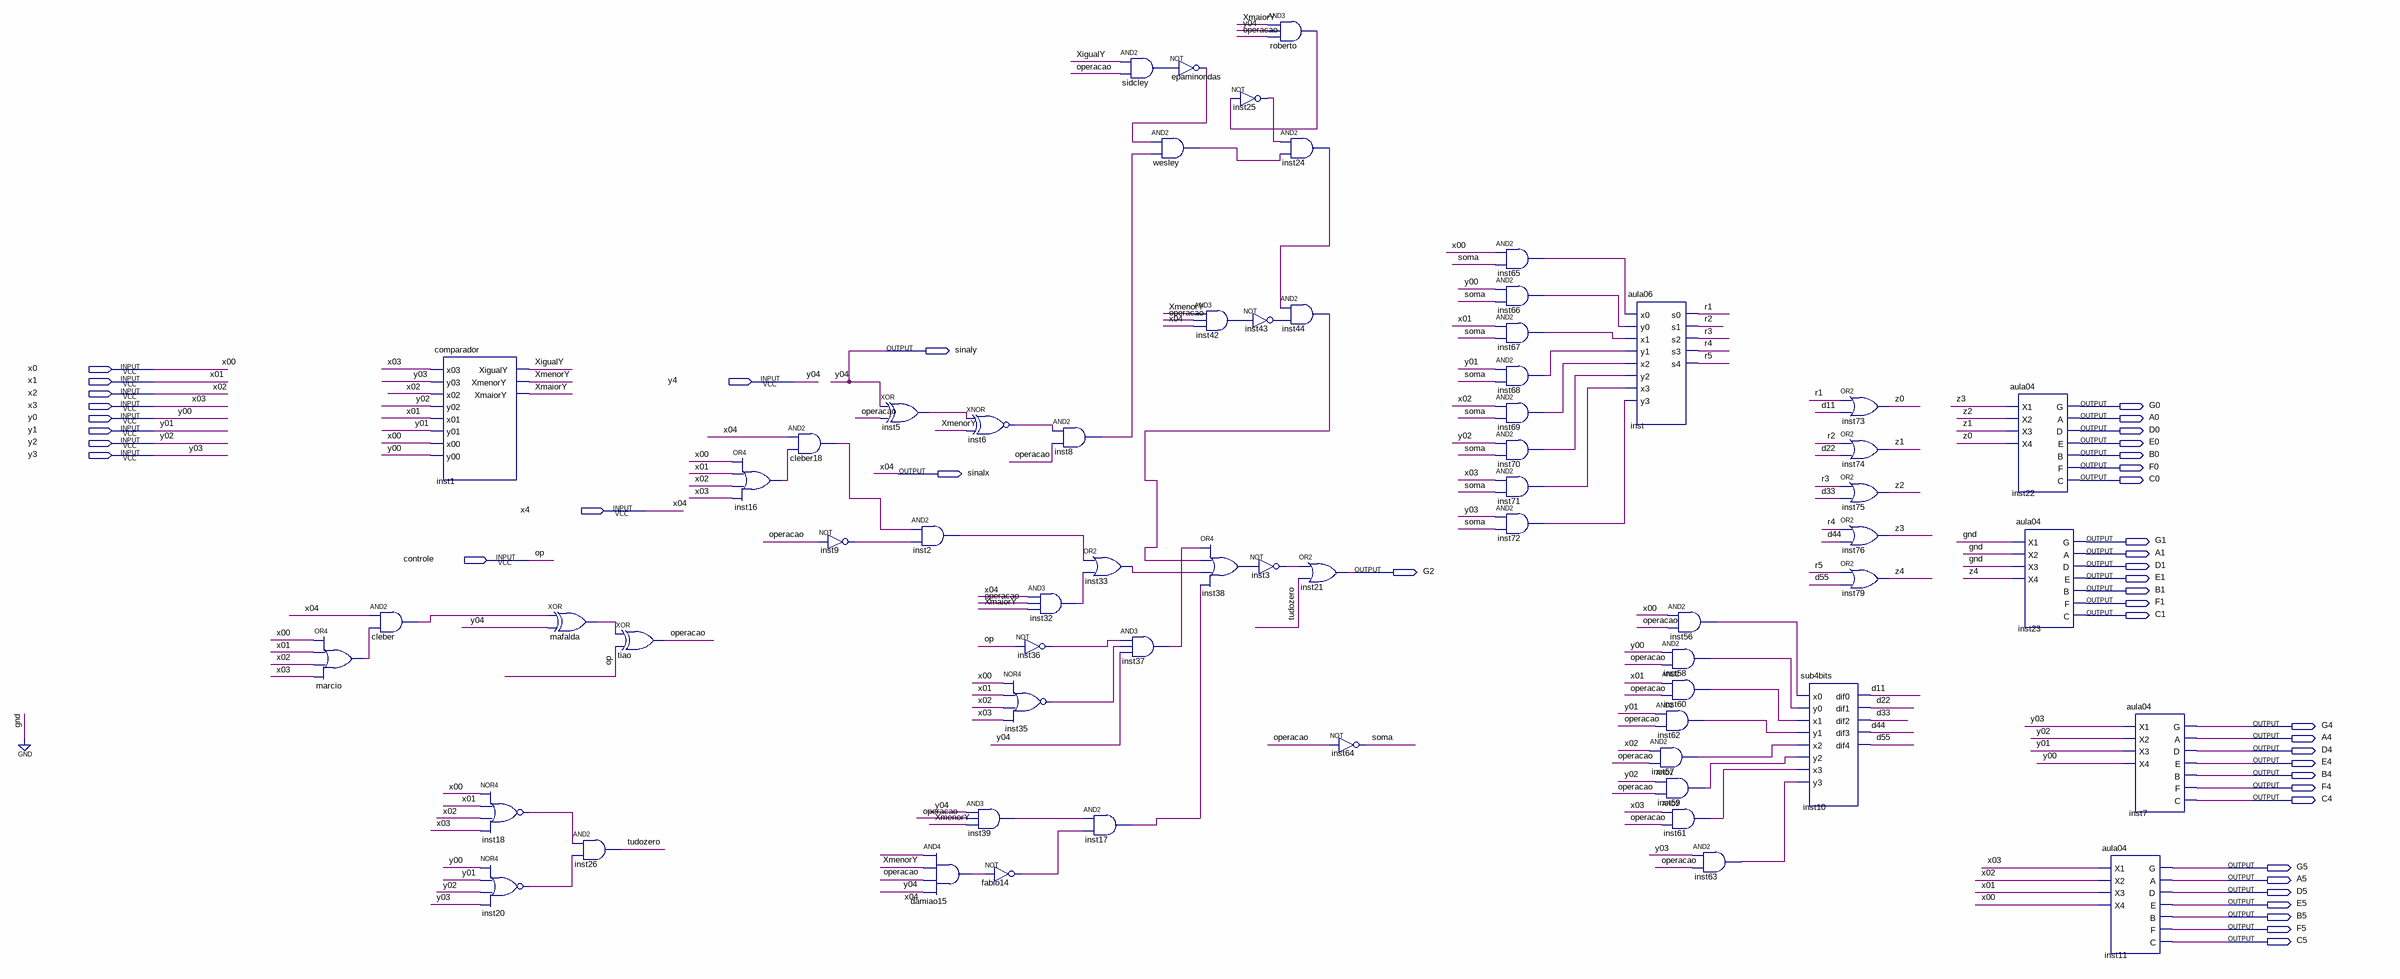
[diagram p0: schematic sheet]
// Quartus schematic aula09.bdf as structural Verilog: 64 symbols, 42 pins
module aula09 (
  input  x0,
  input  x1,
  input  y4,
  input  x2,
  input  x3,
  input  y0,
  input  y1,
  input  y2,
  input  y3,
  input  x4,
  input  controle,
  output sinaly,
  output G0,
  output A0,
  output D0,
  output E0,
  output B0,
  output F0,
  output sinalx,
  output C0,
  output G1,
  output A1,
  output D1,
  output G2,
  output E1,
  output B1,
  output F1,
  output C1,
  output G4,
  output A4,
  output D4,
  output E4,
  output B4,
  output F4,
  output C4,
  output G5,
  output A5,
  output D5,
  output E5,
  output B5,
  output F5,
  output C5
);

  wire cleber18_out, cleber_out, d11, d22, d33, d44, d55, damiao15_out, epaminondas_out, fabio14_out,
       inst2_out, inst3_out, inst5_out, inst6_out, inst8_out, inst9_out, inst16_out, inst17_out, inst18_out,
       inst20_out, inst24_out, inst25_out, inst32_out, inst33_out, inst35_out, inst36_out, inst37_out,
       inst38_out, inst39_out, inst42_out, inst43_out, inst44_out, inst56_out, inst57_out, inst58_out,
       inst59_out, inst60_out, inst61_out, inst62_out, inst63_out, inst65_out, inst66_out, inst67_out,
       inst68_out, inst69_out, inst70_out, inst71_out, inst72_out, mafalda_out, marcio_out, operacao, r1, r2,
       r3, r4, r5, roberto_out, sidcley_out, soma, tudozero, wesley_out, XigualY, XmaiorY, XmenorY, z0, z1,
       z2, z3, z4;

  or marcio (marcio_out, x0, x1, x2, x3);
  and cleber (cleber_out, x4, marcio_out);
  comparador inst1 (
    .x03(x3), .y03(y3), .x02(x2), .y02(y2), .x01(x1), .y01(y1), .x00(x0), .y00(y0), .XigualY(XigualY),
    .XmenorY(XmenorY), .XmaiorY(XmaiorY));
  nor inst18 (inst18_out, x0, x1, x2, x3);
  nor inst20 (inst20_out, y0, y1, y2, y3);
  xor mafalda (mafalda_out, cleber_out, y4);
  and inst26 (tudozero, inst18_out, inst20_out);
  xor tiao (operacao, mafalda_out, controle);
  or inst16 (inst16_out, x0, x1, x2, x3);
  and cleber18 (cleber18_out, x4, inst16_out);
  not inst9 (inst9_out, operacao);
  xor inst5 (inst5_out, y4, operacao);
  and inst2 (inst2_out, cleber18_out, inst9_out);
  and damiao15 (damiao15_out, XmenorY, operacao, y4, x4);
  xnor inst6 (inst6_out, inst5_out, XmenorY);
  and inst39 (inst39_out, y4, operacao, XmenorY);
  not fabio14 (fabio14_out, damiao15_out);
  and inst32 (inst32_out, x4, operacao, XmaiorY);
  not inst36 (inst36_out, controle);
  nor inst35 (inst35_out, x0, x1, x2, x3);
  and inst8 (inst8_out, inst6_out, operacao);
  or inst33 (inst33_out, inst2_out, inst32_out);
  and inst17 (inst17_out, inst39_out, fabio14_out);
  and sidcley (sidcley_out, XigualY, operacao);
  and inst37 (inst37_out, inst36_out, inst35_out, y4);
  not epaminondas (epaminondas_out, sidcley_out);
  and wesley (wesley_out, epaminondas_out, inst8_out);
  not inst25 (inst25_out, roberto_out);
  and inst42 (inst42_out, XmenorY, operacao, x4);
  or inst38 (inst38_out, inst37_out, inst44_out, inst33_out, inst17_out);
  and roberto (roberto_out, XmaiorY, y4, operacao);
  and inst24 (inst24_out, inst25_out, wesley_out);
  and inst44 (inst44_out, inst24_out, inst43_out);
  not inst43 (inst43_out, inst42_out);
  not inst3 (inst3_out, inst38_out);
  or inst21 (G2, inst3_out, tudozero);
  not inst64 (soma, operacao);
  and inst65 (inst65_out, x0, soma);
  and inst66 (inst66_out, y0, soma);
  and inst67 (inst67_out, x1, soma);
  and inst68 (inst68_out, y1, soma);
  and inst69 (inst69_out, x2, soma);
  and inst70 (inst70_out, y2, soma);
  and inst71 (inst71_out, x3, soma);
  and inst72 (inst72_out, y3, soma);
  aula06 inst (
    .x0(inst65_out), .y0(inst66_out), .x1(inst67_out), .y1(inst68_out), .x2(inst69_out), .y2(inst70_out),
    .x3(inst71_out), .y3(inst72_out), .s0(r1), .s1(r2), .s2(r3), .s3(r4), .s4(r5));
  and inst56 (inst56_out, x0, operacao);
  and inst58 (inst58_out, y0, operacao);
  and inst60 (inst60_out, x1, operacao);
  and inst62 (inst62_out, y1, operacao);
  and inst57 (inst57_out, x2, operacao);
  and inst59 (inst59_out, y2, operacao);
  and inst61 (inst61_out, x3, operacao);
  and inst63 (inst63_out, y3, operacao);
  sub4bits inst10 (
    .x0(inst56_out), .y0(inst58_out), .x1(inst60_out), .y1(inst62_out), .x2(inst57_out), .y2(inst59_out),
    .x3(inst61_out), .y3(inst63_out), .dif0(d11), .dif1(d22), .dif2(d33), .dif3(d44), .dif4(d55));
  or inst73 (z0, r1, d11);
  or inst74 (z1, r2, d22);
  or inst75 (z2, r3, d33);
  or inst76 (z3, r4, d44);
  or inst79 (z4, r5, d55);
  aula04 inst22 (.X1(z3), .X2(z2), .X3(z1), .X4(z0), .G(G0), .A(A0), .D(D0), .E(E0), .B(B0), .F(F0), .C(C0));
  aula04 inst23 (.X1(1'b0), .X2(1'b0), .X3(1'b0), .X4(z4), .G(G1), .A(A1), .D(D1), .E(E1), .B(B1), .F(F1), .C(C1));
  aula04 inst11 (.X1(x3), .X2(x2), .X3(x1), .X4(x0), .G(G5), .A(A5), .D(D5), .E(E5), .B(B5), .F(F5), .C(C5));
  aula04 inst7 (.X1(y3), .X2(y2), .X3(y1), .X4(y0), .G(G4), .A(A4), .D(D4), .E(E4), .B(B4), .F(F4), .C(C4));

  assign sinalx = x4;
  assign sinaly = y4;

  // Other names for the same wires on the sheet: op = controle; y04 = y4; x00 = x0; x01 = x1; x02 = x2; x03 = x3;
  //   x04 = x4; y00 = y0; y01 = y1; y02 = y2; y03 = y3
endmodule
